# EAGLE schematic A500_GRAKA_26 (EAGLE 6.6.0)

## Sheet 1 of 2
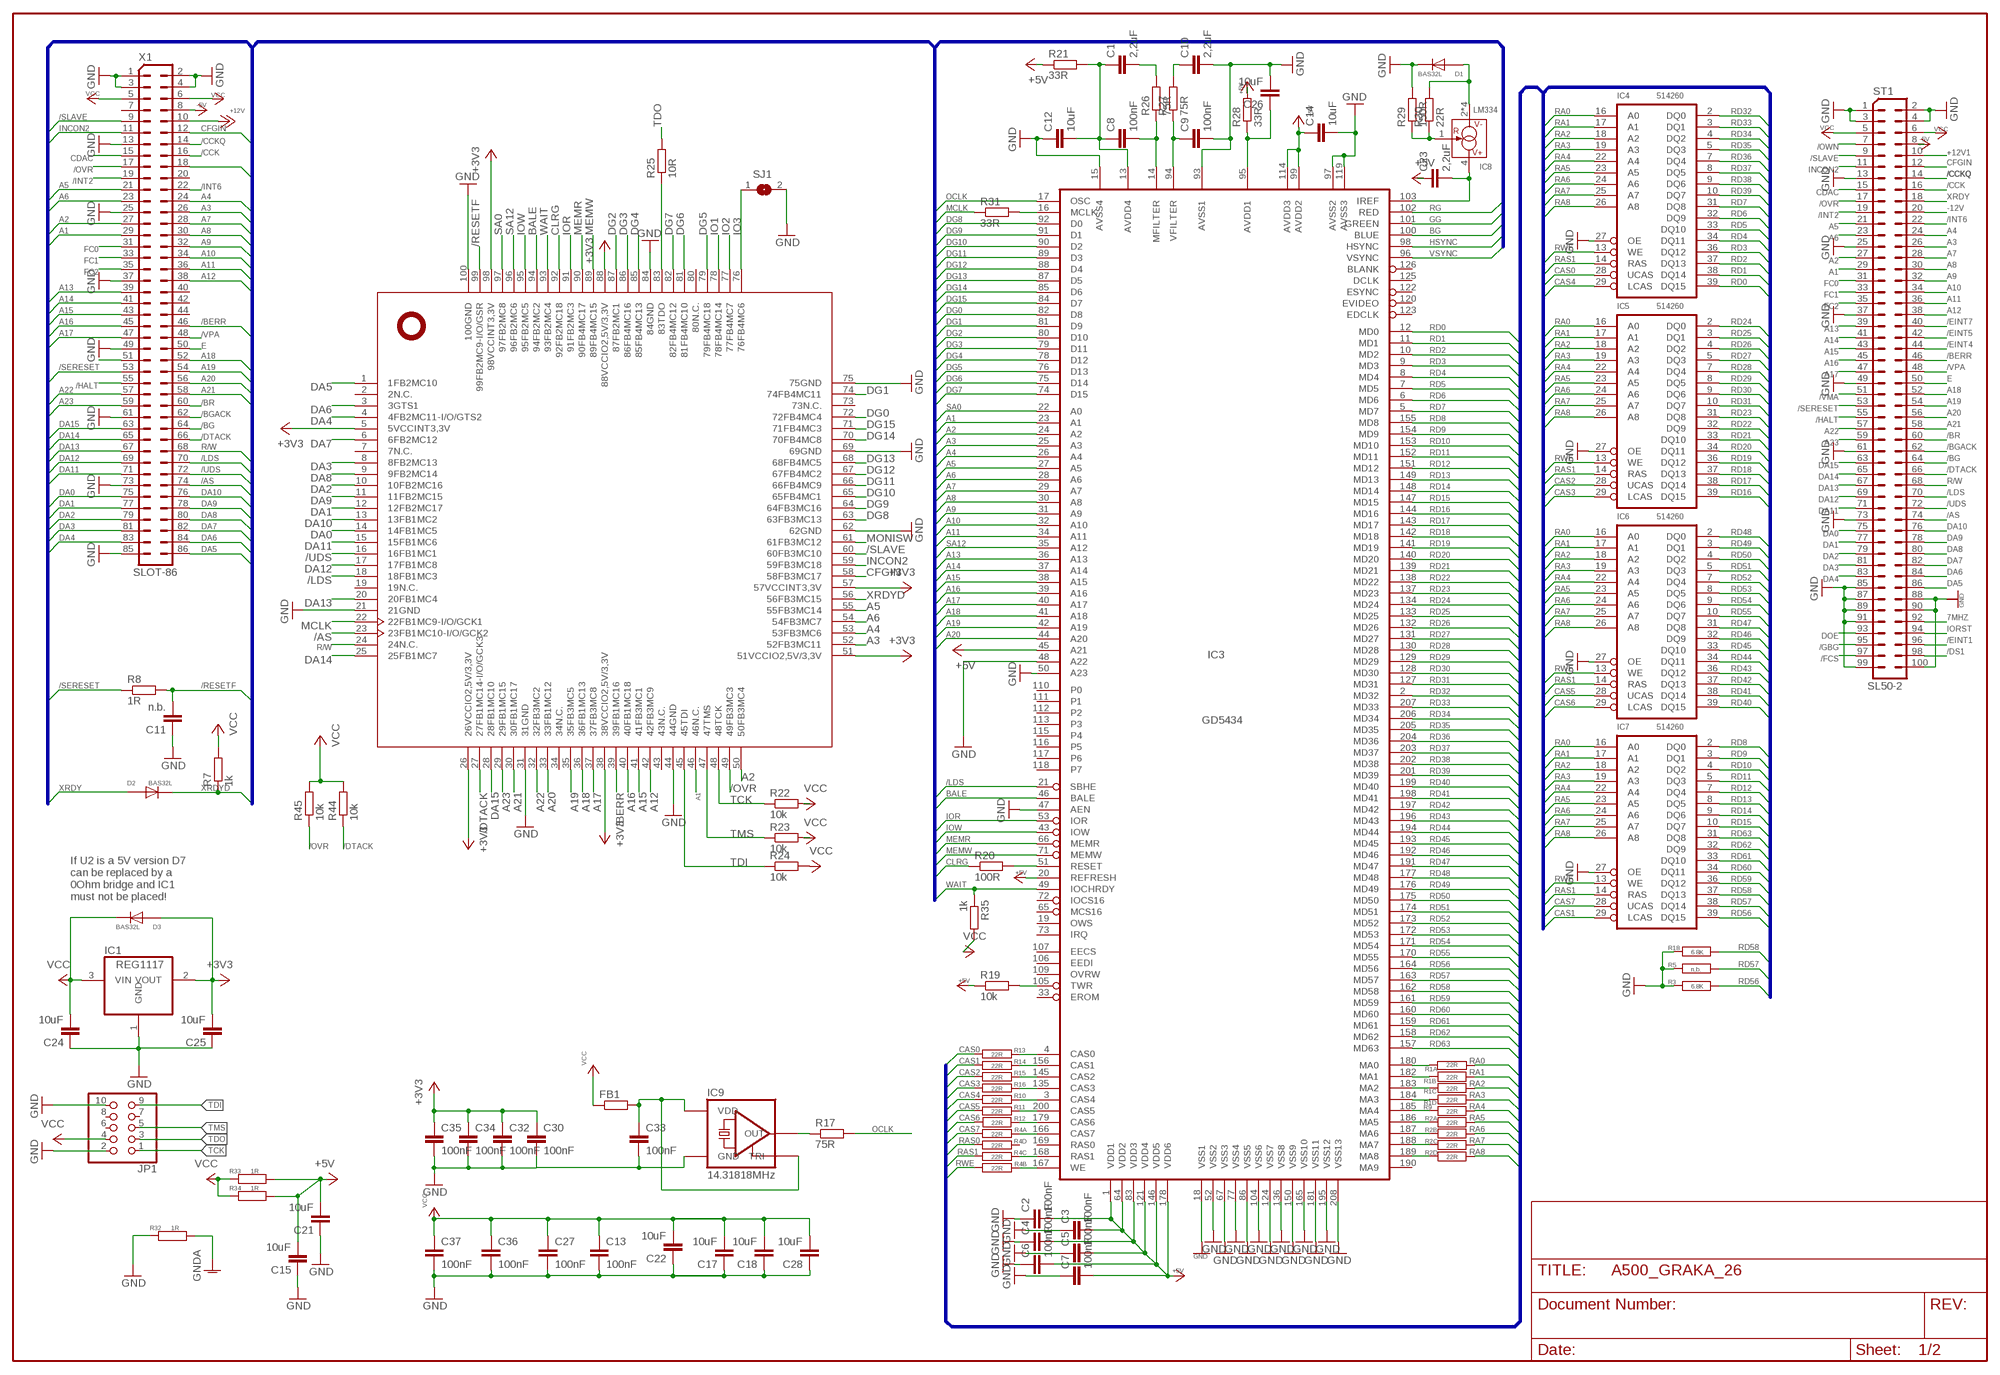
[diagram p0: schematic, sheet 1]

### Parts
C1  2,2uF  C-EUC0805K  [C0805K]
C2  100nF  C-EUC0805K  [C0805K]
C3  100nF  C-EUC0805K  [C0805K]
C4  100nF  C-EUC0805K  [C0805K]
C5  100nF  C-EUC0805K  [C0805K]
C6  100nF  C-EUC0805K  [C0805K]
C7  100nF  C-EUC0805K  [C0805K]
C8  100nF  C-EUC0805K  [C0805K]
C9  100nF  C-EUC0805K  [C0805K]
C10  2,2uF  C-EUC0805K  [C0805K]
C11  n.b.  C-EUC0805K  [C0805K]
C12  10uF  C-EUC0805K  [C0805K]
C13  100nF  C-EUC0805K  [C0805K]
C14  10uF  C-EUC0805K  [C0805K]
C15  10uF  C-EUC0805K  [C0805K]
C17  10uF  C-EUC0805K  [C0805K]
C18  10uF  C-EUC0805K  [C0805K]
C21  10uF  C-EUC0805K  [C0805K]
C22  10uF  C-EUC0805K  [C0805K]
C23  2,2uF  C-EUC0805K  [C0805K]
C24  10uF  C-EUC0805K  [C0805K]
C25  10uF  C-EUC0805K  [C0805K]
C26  10uF  C-EUC0805K  [C0805K]
C27  100nF  C-EUC0805K  [C0805K]
C28  10uF  C-EUC0805K  [C0805K]
C30  100nF  C-EUC0805K  [C0805K]
C32  100nF  C-EUC0805K  [C0805K]
C33  100nF  C-EUC0805K  [C0805K]
C34  100nF  C-EUC0805K  [C0805K]
C35  100nF  C-EUC0805K  [C0805K]
C36  100nF  C-EUC0805K  [C0805K]
C37  100nF  C-EUC0805K  [C0805K]
D1  BAS32L  D-BAS32L  [SOD-80]
D2  BAS32L  D-BAS32L  [SOD-80]
D3  BAS32L  D-BAS32L  [SOD-80]
FB1  R-EU_R0805  [R0805]
IC1  REG1117  [SOT223]
IC2  XC95144XLTQ100  XC9572XLTQ100  [TQ100]
IC3  GD5434  GD5434@3  [PQFP-208@3]
IC4  514260  [SOJ40/4]
IC5  514260  [SOJ40/4]
IC6  514260  [SOJ40/4]
IC7  514260  [SOJ40/4]
IC8  LM334  LM334M(TI)  [SO08]
IC9  14.31818MHz  CSX-750FCFC(5V)  [7X5]
JP1  PINHD-2X5_2.54-SMD  [2X05SMD]
R1  22R  R-NETZ  [R-NETZ]
R2  22R  R-NETZ  [R-NETZ]
R3  6.8K  R-MELF@4  [0805@2]
R4  22R  R-NETZ  [R-NETZ]
R5  n.b.  R-MELF@4  [0805@2]
R7  1k  R-EU_R0805  [R0805]
R8  1R  R-EU_R0805  [R0805]
R9  22R  R-MELF@4  [0805@2]
R10  22R  R-MELF@4  [0805@2]
R11  22R  R-MELF@4  [0805@2]
R12  22R  R-MELF@4  [0805@2]
R13  22R  R-MELF@4  [0805@2]
R14  22R  R-MELF@4  [0805@2]
R15  22R  R-MELF@4  [0805@2]
R16  22R  R-MELF@4  [0805@2]
R17  75R  R-EU_R0805  [R0805]
R18  6.8K  R-MELF@4  [0805@2]
R19  10k  R-EU_R0805  [R0805]
R20  100R  R-EU_R0805  [R0805]
R21  33R  R-EU_R0805  [R0805]
R22  10k  R-EU_R0805  [R0805]
R23  10k  R-EU_R0805  [R0805]
R24  10k  R-EU_R0805  [R0805]
R25  10R  R-EU_R0805  [R0805]
R26  75R  R-EU_R0805  [R0805]
R27  75R  R-EU_R0805  [R0805]
R28  33R  R-EU_R0805  [R0805]
R29  150R  R-EU_R0805  [R0805]
R30  22R  R-EU_R0805  [R0805]
R31  33R  R-EU_R0805  [R0805]
R32  1R  R-MELF@3  [0204]
R33  1R  R-MELF@3  [0204]
R34  1R  R-MELF@3  [0204]
R35  1k  R-EU_R0805  [R0805]
R44  10k  R-EU_R0805  [R0805]
R45  10k  R-EU_R0805  [R0805]
SJ1  SJ  [SJ]
ST1  SL50-2  SL50-2@3  [LKOT-501]
X1  SLOT-86  [SLOT-86]

### Nets
7MHZ: ST1.92
+3V3: C25.2 C30.1 C32.1 C34.1 C35.1 D3.1(A) IC1.2(VOUT) IC2.5(5VCCINT3,3V) IC2.26(26VCCIO2,5V/3,3V) IC2.38(38VCCIO2,5V/3,3V) IC2.51(51VCCIO2,5V/3,3V) IC2.57(57VCCINT3,3V) IC2.88(88VCCIO2,5V/3,3V) IC2.98(98VCCINT3,3V)
+5V: C2.2 C3.2 C4.2 C5.2 C6.2 C7.2 C14.1 C15.2 C21.2 C23.1 IC3.1(VDD1) IC3.20(REFRESH) IC3.45(A21) IC3.64(VDD2) IC3.83(VDD3) IC3.99(AVDD2) IC3.114(AVDD3) IC3.121(VDD4) IC3.146(VDD5) IC3.178(VDD6) R19.1 R21.1 R28.2 R33.1 R34.1
+12V: X1.10
+12V1: ST1.10
-5V: ST1.8 X1.8
-12V: ST1.20
/AS: IC2.23(23FB1MC10-I/O/GCK2) ST1.74 X1.74
/BERR: IC2.39(39FB1MC16) ST1.46 X1.46
/BG: ST1.64 X1.64
/BGACK: ST1.62 X1.62
/BR: ST1.60 X1.60
/CCK: ST1.16 X1.16
/CCKQ: ST1.14 X1.14
/DS1: ST1.98
/DTACK: IC2.27(27FB1MC14-I/O/GCK3) R44.1 ST1.66 X1.66
/EINT1: ST1.96
/EINT4: ST1.44
/EINT5: ST1.42
/EINT7: ST1.40
/FCS: ST1.97
/GBG: ST1.95
/HALT: ST1.55 X1.55
/INT2: ST1.19 X1.19
/INT6: ST1.22 X1.22
/LDS: IC2.18(18FB1MC3) IC3.21(SBHE) ST1.70 X1.70
/OVR: IC2.49(49FB3MC3) R45.1 ST1.17 X1.17
/OWN: ST1.7
/RESETF: C11.2 IC2.99(99FB2MC9-I/O/GSR) R8.2
/SERESET: R8.1 ST1.53 X1.53
/SLAVE: IC2.60(60FB3MC10) ST1.9 X1.9
/UDS: IC2.16(16FB1MC1) ST1.72 X1.72
/VMA: ST1.51 X1.51
/VPA: ST1.48 X1.48
A1: IC2.46(46N.C.) IC3.23(A1) ST1.29 X1.29
A2: IC2.50(50FB3MC4) IC3.24(A2) ST1.27 X1.27
A3: IC2.52(52FB3MC11) IC3.25(A3) ST1.26 X1.26
A4: IC2.53(53FB3MC6) IC3.26(A4) ST1.24 X1.24
A5: IC2.55(55FB3MC14) IC3.27(A5) ST1.21 X1.21
A6: IC2.54(54FB3MC7) IC3.28(A6) ST1.23 X1.23
A7: IC3.29(A7) ST1.28 X1.28
A8: IC3.30(A8) ST1.30 X1.30
A9: IC3.31(A9) ST1.32 X1.32
A10: IC3.32(A10) ST1.34 X1.34
A11: IC3.34(A11) ST1.36 X1.36
A12: IC2.42(42FB3MC9) ST1.38 X1.38
A13: IC3.36(A13) ST1.39 X1.39
A14: IC3.37(A14) ST1.41 X1.41
A15: IC2.41(41FB3MC1) IC3.38(A15) ST1.43 X1.43
A16: IC2.40(40FB1MC18) IC3.39(A16) ST1.45 X1.45
A17: IC2.37(37FB3MC8) IC3.40(A17) ST1.47 X1.47
A18: IC2.36(36FB1MC13) IC3.41(A18) ST1.52 X1.52
A19: IC2.35(35FB3MC5) IC3.42(A19) ST1.54 X1.54
A20: IC2.33(33FB1MC12) IC3.44(A20) ST1.56 X1.56
A21: IC2.30(30FB1MC17) ST1.58 X1.58
A22: IC2.32(32FB3MC2) ST1.57 X1.57
A23: IC2.29(29FB1MC15) ST1.59 X1.59
AVDD1: C26.1 IC3.95(AVDD1) R28.1
AVDD4: C1.1 C8.1 C12.2 IC3.13(AVDD4) R21.2
BALE: IC2.94(94FB2MC2) IC3.46(BALE)
BG: IC3.100(BLUE) ; also sheet 2
CAS0: IC4.28(UCAS) R13.1
CAS1: IC7.29(LCAS) R14.1
CAS2: IC5.28(UCAS) R15.1
CAS3: IC5.29(LCAS) R16.1
CAS4: IC4.29(LCAS) R10.1
CAS5: IC6.28(UCAS) R11.1
CAS6: IC6.29(LCAS) R12.2
CAS7: IC7.28(UCAS) R4.P$1
CDAC: ST1.15 X1.15
CFGIN: IC2.58(58FB3MC17) ST1.12 X1.12
CLRG: IC2.92(92FB2MC18) R20.1
DA0: IC2.14(14FB1MC5) ST1.75 X1.75
DA1: IC2.12(12FB2MC17) ST1.77 X1.77
DA2: IC2.10(10FB2MC16) ST1.79 X1.79
DA3: IC2.8(8FB2MC13) ST1.81 X1.81
DA4: IC2.4(4FB2MC11-I/O/GTS2) ST1.83 X1.83
DA5: IC2.1(1FB2MC10) ST1.86 X1.86
DA6: IC2.3(3GTS1) ST1.84 X1.84
DA7: IC2.6(6FB2MC12) ST1.82 X1.82
DA8: IC2.9(9FB2MC14) ST1.80 X1.80
DA9: IC2.11(11FB2MC15) ST1.78 X1.78
DA10: IC2.13(13FB1MC2) ST1.76 X1.76
DA11: IC2.15(15FB1MC6) ST1.71 X1.71
DA12: IC2.17(17FB1MC8) ST1.69 X1.69
DA13: IC2.20(20FB1MC4) ST1.67 X1.67
DA14: IC2.25(25FB1MC7) ST1.65 X1.65
DA15: IC2.28(28FB1MC10) ST1.63 X1.63
DG0: IC2.72(72FB4MC4) IC3.82(D8)
DG1: IC2.74(74FB4MC11) IC3.81(D9)
DG2: IC2.87(87FB2MC1) IC3.80(D10)
DG3: IC2.86(86FB4MC16) IC3.79(D11)
DG4: IC2.85(85FB4MC13) IC3.78(D12)
DG5: IC2.79(79FB4MC18) IC3.76(D13)
DG6: IC2.81(81FB4MC10) IC3.75(D14)
DG7: IC2.82(82FB4MC12) IC3.74(D15)
DG8: IC2.63(63FB3MC13) IC3.92(D0)
DG9: IC2.64(64FB3MC16) IC3.91(D1)
DG10: IC2.65(65FB4MC1) IC3.90(D2)
DG11: IC2.66(66FB4MC9) IC3.89(D3)
DG12: IC2.67(67FB4MC2) IC3.88(D4)
DG13: IC2.68(68FB4MC5) IC3.87(D5)
DG14: IC2.70(70FB4MC8) IC3.85(D6)
DG15: IC2.71(71FB4MC3) IC3.84(D7)
DOE: ST1.93
E: ST1.50 X1.50
FC0: ST1.31 X1.31
FC1: ST1.33 X1.33
FC2: ST1.35 X1.35
GG: IC3.101(GREEN) ; also sheet 2
GND: C2.1 C3.1 C4.1 C5.1 C6.1 C7.1 C9.2 C10.2 C11.1 C12.1 C13.2 C14.2 C15.1 C17.1 C18.1 C21.1 C22.1 C24.1 C25.1 C26.2 C27.2 C28.1 C30.2 C32.2 C33.2 C34.2 C35.2 C36.2 C37.2 D1.2(K) IC1.1(GND) IC2.21(21GND) IC2.31(31GND) IC2.44(44GND) IC2.62(62GND) IC2.69(69GND) IC2.75(75GND) IC2.84(84GND) IC2.100(100GND) IC3.15(AVSS4) IC3.18(VSS1) IC3.47(AEN) IC3.48(A22) IC3.50(A23) IC3.52(VSS2) IC3.67(VSS3) IC3.77(VSS4) IC3.86(VSS5) IC3.93(AVSS1) IC3.97(AVSS2) IC3.104(VSS6) IC3.119(AVSS3) IC3.124(VSS7) IC3.136(VSS8) IC3.150(VSS9) IC3.165(VSS10) IC3.181(VSS11) IC3.195(VSS12) IC3.208(VSS13) IC4.27(OE) IC5.27(OE) IC6.27(OE) IC7.27(OE) IC9.P$2(GND) JP1.2 JP1.10 R3.2 R5.2 R18.2 R29.2 R32.2 SJ1.2 ST1.1 ST1.2 ST1.3 ST1.4 ST1.13 ST1.25 ST1.37 ST1.49 ST1.61 ST1.73 ST1.85 ST1.87 ST1.88 ST1.89 ST1.90 ST1.91 ST1.99 ST1.100 X1.1 X1.2 X1.3 X1.4 X1.13 X1.25 X1.37 X1.49 X1.61 X1.73 X1.85 ; also sheet 2
GNDA: R32.1 ; also sheet 2
HSYNC: IC3.98(HSYNC) ; also sheet 2
INCON2: IC2.59(59FB3MC18) ST1.11 X1.11
IO1: IC2.78(78FB4MC14)
IO2: IC2.77(77FB4MC7)
IO3: IC2.76(76FB4MC6) SJ1.1
IOR: IC2.91(91FB2MC3) IC3.53(IOR)
IORST: ST1.94
IOW: IC2.95(95FB2MC5) IC3.43(IOW)
MCLK: IC2.22(22FB1MC9-I/O/GCK1) R31.1
MEMR: IC2.90(90FB4MC17) IC3.66(MEMR)
MEMW: IC2.89(89FB4MC15) IC3.71(MEMW)
MONISW: IC2.61(61FB3MC12) ; also sheet 2
N$1: IC3.185(MA4) R9.2
N$2: IC3.180(MA0) R1.P$8
N$3: IC3.182(MA1) R1.P$7
N$4: IC3.186(MA5) R2.P$8
N$5: IC3.187(MA6) R2.P$7
N$6: IC3.188(MA7) R2.P$6
N$7: IC3.189(MA8) R2.P$5
N$8: IC3.183(MA2) R1.P$6
N$9: C33.1 FB1.2 IC9.P$1(TRI) IC9.P$4(VDD)
N$11: IC3.184(MA3) R1.P$5
N$12: IC3.3(CAS4) R10.2
N$13: IC3.200(CAS5) R11.2
N$14: IC3.179(CAS6) R12.1
N$16: IC3.4(CAS0) R13.2
N$17: IC3.156(CAS1) R14.2
N$18: IC3.145(CAS2) R15.2
N$19: IC3.135(CAS3) R16.2
N$20: IC3.16(MCLK) R31.2
N$21: IC9.P$3(OUT) R17.1
N$23: C1.2 R26.2
N$24: C8.2 IC3.14(MFILTER) R26.1
N$26: C9.1 IC3.94(VFILTER) R27.1
N$28: IC3.51(RESET) R20.2
N$29: C10.1 R27.2
N$30: C23.2 IC3.103(IREF) IC8.4(V+)
N$31: IC8.1(R) R29.1 R30.1
N$32: D1.1(A) IC8.2(V-) IC8.3(V-) IC8.6(V-) IC8.7(V-) R30.2
N$46: IC3.105(TWR) R19.2
N$51: IC3.166(CAS7) R4.P$8
N$53: IC3.168(RAS1) R4.P$6
N$54: IC3.167(WE) R4.P$7
OCLK: IC3.17(OSC) R17.2
R/W: IC2.24(24N.C.) ST1.68 X1.68
RA0: IC4.16(A0) IC5.16(A0) IC6.16(A0) IC7.16(A0) R1.P$1
RA1: IC4.17(A1) IC5.17(A1) IC6.17(A1) IC7.17(A1) R1.P$2
RA2: IC4.18(A2) IC5.18(A2) IC6.18(A2) IC7.18(A2) R1.P$3
RA3: IC4.19(A3) IC5.19(A3) IC6.19(A3) IC7.19(A3) R1.P$4
RA4: IC4.22(A4) IC5.22(A4) IC6.22(A4) IC7.22(A4) R9.1
RA5: IC4.23(A5) IC5.23(A5) IC6.23(A5) IC7.23(A5) R2.P$1
RA6: IC4.24(A6) IC5.24(A6) IC6.24(A6) IC7.24(A6) R2.P$2
RA7: IC4.25(A7) IC5.25(A7) IC6.25(A7) IC7.25(A7) R2.P$3
RA8: IC4.26(A8) IC5.26(A8) IC6.26(A8) IC7.26(A8) R2.P$4
RAS0: R4.P$4
RAS1: IC4.14(RAS) IC5.14(RAS) IC6.14(RAS) IC7.14(RAS) R4.P$3
RD0: IC3.12(MD0) IC4.39(DQ15)
RD1: IC3.11(MD1) IC4.38(DQ14)
RD2: IC3.10(MD2) IC4.37(DQ13)
RD3: IC3.9(MD3) IC4.36(DQ12)
RD4: IC3.8(MD4) IC4.34(DQ11)
RD5: IC3.7(MD5) IC4.33(DQ10)
RD6: IC3.6(MD6) IC4.32(DQ9)
RD7: IC3.5(MD7) IC4.31(DQ8)
RD8: IC3.155(MD8) IC7.2(DQ0)
RD9: IC3.154(MD9) IC7.3(DQ1)
RD10: IC3.153(MD10) IC7.4(DQ2)
RD11: IC3.152(MD11) IC7.5(DQ3)
RD12: IC3.151(MD12) IC7.7(DQ4)
RD13: IC3.149(MD13) IC7.8(DQ5)
RD14: IC3.148(MD14) IC7.9(DQ6)
RD15: IC3.147(MD15) IC7.10(DQ7)
RD16: IC3.144(MD16) IC5.39(DQ15)
RD17: IC3.143(MD17) IC5.38(DQ14)
RD18: IC3.142(MD18) IC5.37(DQ13)
RD19: IC3.141(MD19) IC5.36(DQ12)
RD20: IC3.140(MD20) IC5.34(DQ11)
RD21: IC3.139(MD21) IC5.33(DQ10)
RD22: IC3.138(MD22) IC5.32(DQ9)
RD23: IC3.137(MD23) IC5.31(DQ8)
RD24: IC3.134(MD24) IC5.2(DQ0)
RD25: IC3.133(MD25) IC5.3(DQ1)
RD26: IC3.132(MD26) IC5.4(DQ2)
RD27: IC3.131(MD27) IC5.5(DQ3)
RD28: IC3.130(MD28) IC5.7(DQ4)
RD29: IC3.129(MD29) IC5.8(DQ5)
RD30: IC3.128(MD30) IC5.9(DQ6)
RD31: IC3.127(MD31) IC5.10(DQ7)
RD32: IC3.2(MD32) IC4.2(DQ0)
RD33: IC3.207(MD33) IC4.3(DQ1)
RD34: IC3.206(MD34) IC4.4(DQ2)
RD35: IC3.205(MD35) IC4.5(DQ3)
RD36: IC3.204(MD36) IC4.7(DQ4)
RD37: IC3.203(MD37) IC4.8(DQ5)
RD38: IC3.202(MD38) IC4.9(DQ6)
RD39: IC3.201(MD39) IC4.10(DQ7)
RD40: IC3.199(MD40) IC6.39(DQ15)
RD41: IC3.198(MD41) IC6.38(DQ14)
RD42: IC3.197(MD42) IC6.37(DQ13)
RD43: IC3.196(MD43) IC6.36(DQ12)
RD44: IC3.194(MD44) IC6.34(DQ11)
RD45: IC3.193(MD45) IC6.33(DQ10)
RD46: IC3.192(MD46) IC6.32(DQ9)
RD47: IC3.191(MD47) IC6.31(DQ8)
RD48: IC3.177(MD48) IC6.2(DQ0)
RD49: IC3.176(MD49) IC6.3(DQ1)
RD50: IC3.175(MD50) IC6.4(DQ2)
RD51: IC3.174(MD51) IC6.5(DQ3)
RD52: IC3.173(MD52) IC6.7(DQ4)
RD53: IC3.172(MD53) IC6.8(DQ5)
RD54: IC3.171(MD54) IC6.9(DQ6)
RD55: IC3.170(MD55) IC6.10(DQ7)
RD56: IC3.164(MD56) IC7.39(DQ15) R3.1
RD57: IC3.163(MD57) IC7.38(DQ14) R5.1
RD58: IC3.162(MD58) IC7.37(DQ13) R18.1
RD59: IC3.161(MD59) IC7.36(DQ12)
RD60: IC3.160(MD60) IC7.34(DQ11)
RD61: IC3.159(MD61) IC7.33(DQ10)
RD62: IC3.158(MD62) IC7.32(DQ9)
RD63: IC3.157(MD63) IC7.31(DQ8)
RG: IC3.102(RED) ; also sheet 2
RWE: IC4.13(WE) IC5.13(WE) IC6.13(WE) IC7.13(WE) R4.P$2
SA0: IC2.97(97FB2MC8) IC3.22(A0)
SA12: IC2.96(96FB2MC6) IC3.35(A12)
TCK: IC2.48(48TCK) JP1.1 R22.1
TDI: IC2.45(45TDI) JP1.9 R24.1
TDO: JP1.3 R25.2
TDO1: IC2.83(83TDO) R25.1
TMS: IC2.47(47TMS) JP1.5 R23.1
VCC: C13.1 C17.2 C18.2 C22.2 C24.2 C27.1 C28.2 C36.1 C37.1 D3.2(K) FB1.1 IC1.3(VIN) JP1.4 R7.2 R22.2 R23.2 R24.2 R33.2 R34.2 R35.2 R44.2 R45.2 ST1.5 ST1.6 X1.5 X1.6 ; also sheet 2
VSYNC: IC3.96(VSYNC) ; also sheet 2
WAIT: IC2.93(93FB2MC4) IC3.49(IOCHRDY) R35.1
XRDY: D2.1(A) ST1.18 X1.18
XRDYD: D2.2(K) IC2.56(56FB3MC15) R7.1
Unconnected: IC2.2(2N.C.) IC2.7(7N.C.) IC2.19(19N.C.) IC2.34(34N.C.) IC2.43(43N.C.) IC2.73(73N.C.) IC2.80(80N.C.) IC3.19(OWS) IC3.33(EROM) IC3.65(MCS16) IC3.72(IOCS16) IC3.73(IRQ) IC3.106(EEDI) IC3.107(EECS) IC3.109(OVRW) IC3.110(P0) IC3.111(P1) IC3.112(P2) IC3.113(P3) IC3.115(P4) IC3.116(P5) IC3.117(P6) IC3.118(P7) IC3.120(EVIDEO) IC3.122(ESYNC) IC3.123(EDCLK) IC3.125(DCLK) IC3.126(BLANK) IC3.169(RAS0) IC3.190(MA9) JP1.6 JP1.7 JP1.8 R4.P$5 X1.7 X1.20 X1.40 X1.42 X1.44

### Buses
A[1..23],DA[0..15],DG[0..15],SA0,SA12,IOW,IOR,MEMW,MEMR,WAIT,SBHE,BALE,MCLK,IRQ,CAP[16..23],OEAG,OEGA,LEGA,/AS,/BERR
RD[0..63],RA[0..8],RAS[0..1],LCAS[0..1],UCAS[0..1]

### Notes on the sheet
- /CCKQ | /CCKQ
- /CCK
- -12V
- /INT6
- /EINT7
- /EINT5
- /EINT4
- /VPA
- E
- /BR
- /BGACK
- /BG
- /DTACK
- If U2 is a 5V version D7 
  can be replaced by a 
  0Ohm bridge and IC1 
  must not be placed!

## Sheet 2 of 2
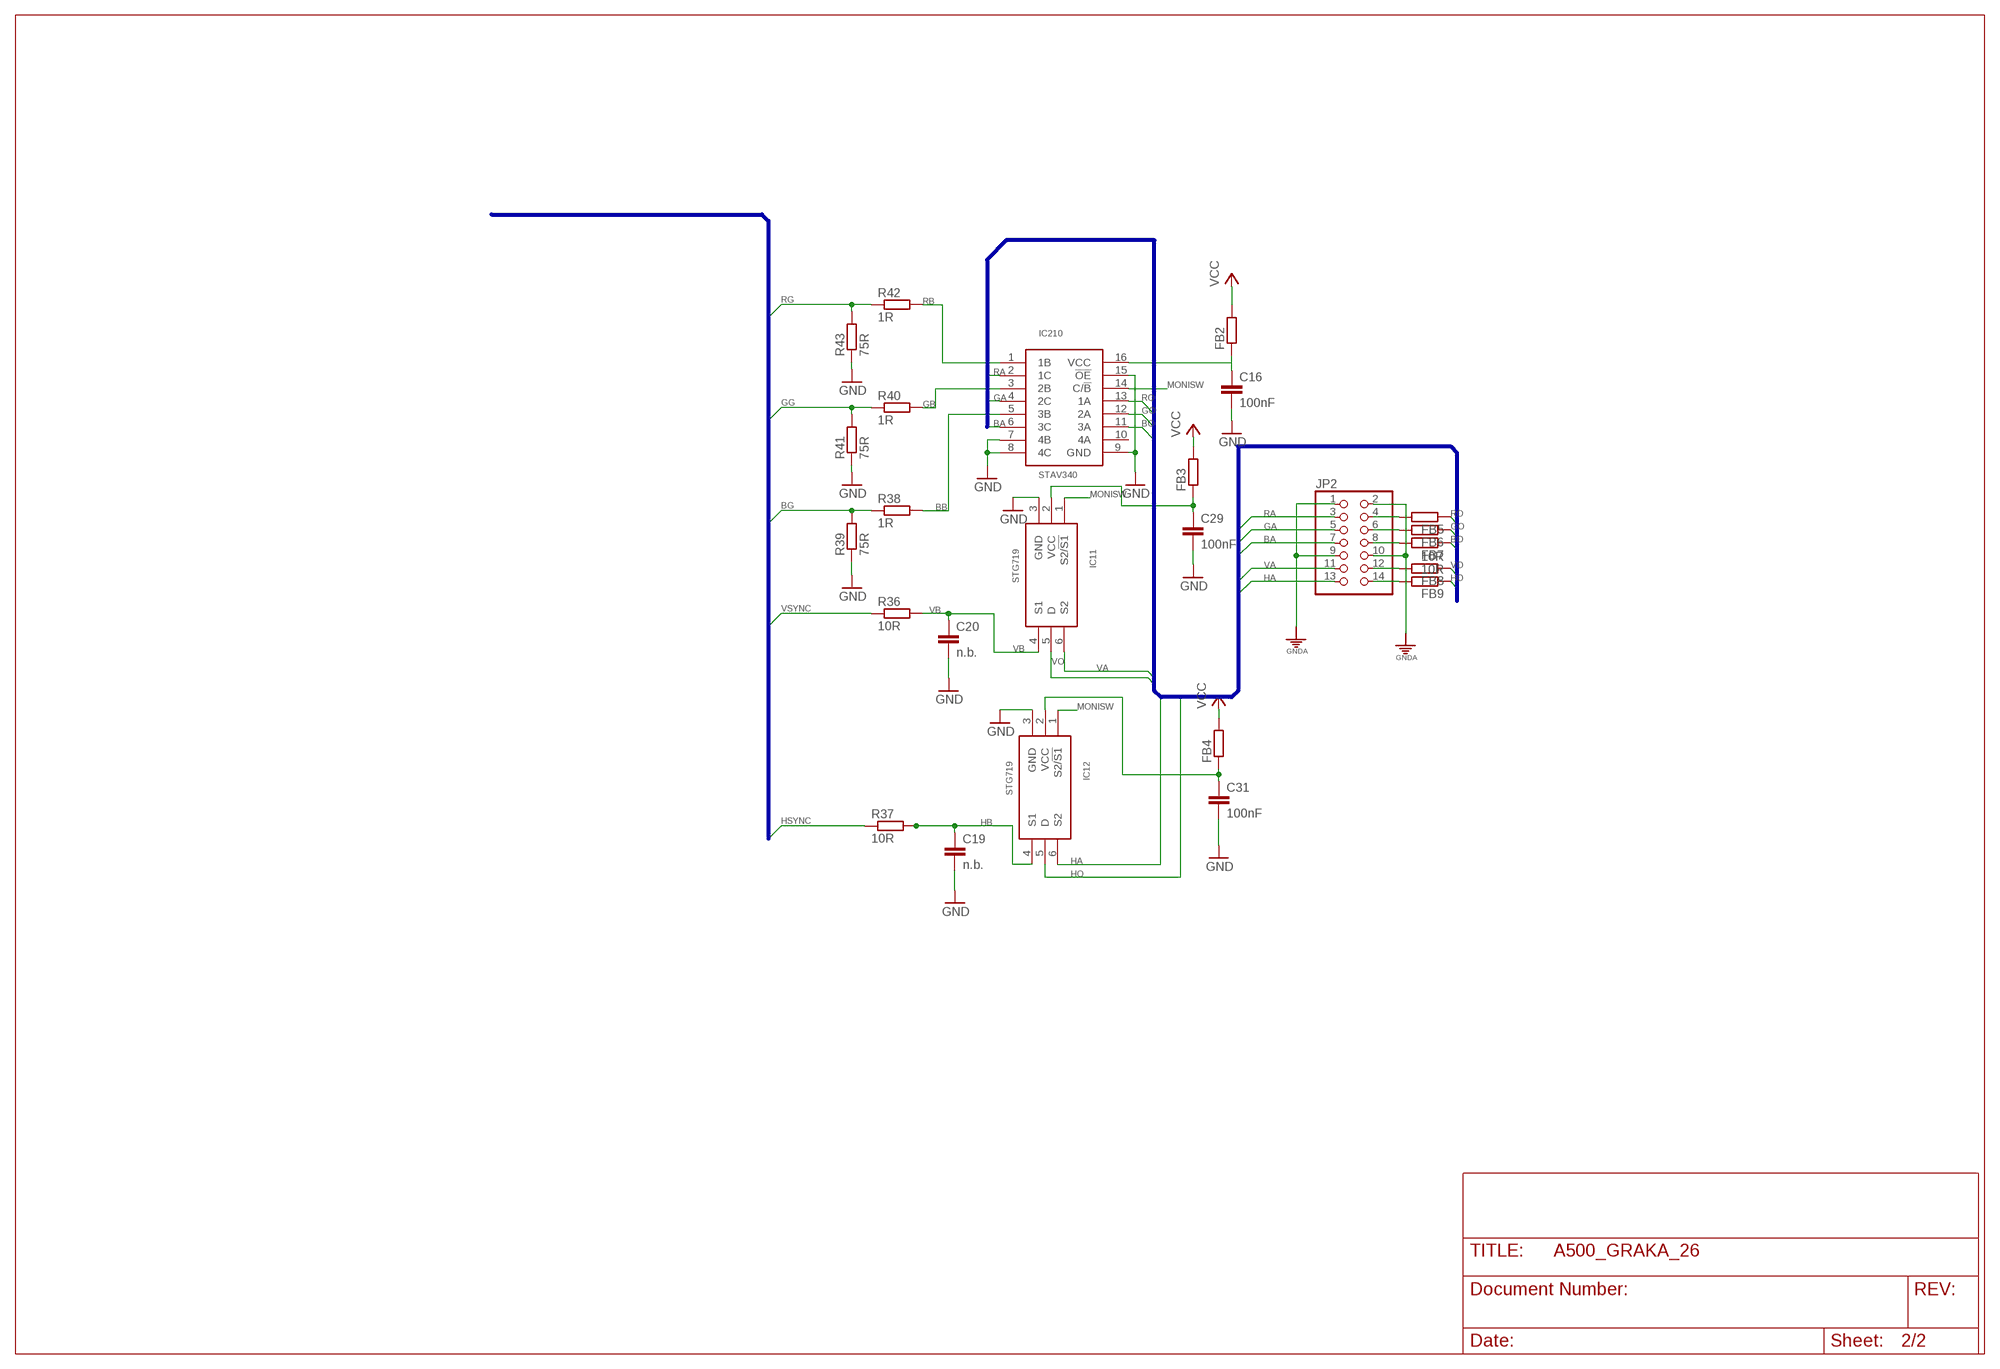
[diagram p1: schematic, sheet 2]

### Parts
C16  100nF  C-EUC0805K  [C0805K]
C19  n.b.  C-EUC0805K  [C0805K]
C20  n.b.  C-EUC0805K  [C0805K]
C29  100nF  C-EUC0805K  [C0805K]
C31  100nF  C-EUC0805K  [C0805K]
FB2  R-EU_R0805  [R0805]
FB3  R-EU_R0805  [R0805]
FB4  R-EU_R0805  [R0805]
FB5  R-EU_R0805  [R0805]
FB6  R-EU_R0805  [R0805]
FB7  R-EU_R0805  [R0805]
FB8  10R  R-EU_R0805  [R0805]
FB9  10R  R-EU_R0805  [R0805]
IC11  STG719  [SOT23-6L]
IC12  STG719  [SOT23-6L]
IC210  STAV340  [TSSOP16]
JP2  PINHD-2X7_2.54-SMD  [2X07SMD]
R36  10R  R-EU_R0805  [R0805]
R37  10R  R-EU_R0805  [R0805]
R38  1R  R-EU_R0805  [R0805]
R39  75R  R-EU_R0805  [R0805]
R40  1R  R-EU_R0805  [R0805]
R41  75R  R-EU_R0805  [R0805]
R42  1R  R-EU_R0805  [R0805]
R43  75R  R-EU_R0805  [R0805]

### Nets
BA: IC210.6(3C) JP2.7
BB: IC210.5(3B) R38.2
BG: R38.1 R39.2 ; also sheet 1
BO: FB7.1 IC210.11(3A)
GA: IC210.4(2C) JP2.5
GB: IC210.3(2B) R40.2
GG: R40.1 R41.2 ; also sheet 1
GND: C16.2 C19.2 C20.2 C29.2 C31.2 IC11.3(GND) IC12.3(GND) IC210.7(4B) IC210.8(4C) IC210.9(GND) IC210.15(!OE) R39.1 R41.1 R43.1 ; also sheet 1
GNDA: JP2.1 JP2.2 JP2.9 JP2.10 ; also sheet 1
GO: FB6.1 IC210.12(2A)
HA: IC12.6(S2) JP2.13
HB: C19.1 IC12.4(S1) R37.2
HO: FB9.1 IC12.5(D)
HSYNC: R37.1 ; also sheet 1
MONISW: IC11.1(S2/!S1) IC12.1(S2/!S1) IC210.14(C/!B) ; also sheet 1
N$22: C16.1 FB2.1 IC210.16(VCC)
N$25: FB7.2 JP2.8
N$27: C29.1 FB3.1 IC11.2(VCC)
N$33: C31.1 FB4.1 IC12.2(VCC)
N$34: FB6.2 JP2.6
N$35: FB5.2 JP2.4
N$36: FB8.2 JP2.12
N$37: FB9.2 JP2.14
RA: IC210.2(1C) JP2.3
RB: IC210.1(1B) R42.2
RG: R42.1 R43.2 ; also sheet 1
RO: FB5.1 IC210.13(1A)
VA: IC11.6(S2) JP2.11
VB: C20.1 IC11.4(S1) R36.2
VCC: FB2.2 FB3.2 FB4.2 ; also sheet 1
VO: FB8.1 IC11.5(D)
VSYNC: R36.1 ; also sheet 1
Unconnected: IC210.10(4A)

### Buses
RA,GA,BA,VA,HA,RO,GO,BO,VO,HO
A[1..23],DA[0..15],DG[0..15],SA0,SA12,IOW,IOR,MEMW,MEMR,WAIT,SBHE,BALE,MCLK,IRQ,CAP[16..23],OEAG,OEGA,LEGA,/AS,/BERR

## Power pins joined to a net without a drawn wire
GND: IC4.21(GND) IC4.35(GND) IC4.40(GND) IC5.21(GND) IC5.35(GND) IC5.40(GND) IC6.21(GND) IC6.35(GND) IC6.40(GND) IC7.21(GND) IC7.35(GND) IC7.40(GND)
VCC: IC4.1(VCC) IC4.6(VCC) IC4.20(VCC) IC5.1(VCC) IC5.6(VCC) IC5.20(VCC) IC6.1(VCC) IC6.6(VCC) IC6.20(VCC) IC7.1(VCC) IC7.6(VCC) IC7.20(VCC)

## Library data of the parts
C1-C37 = rcl:C-EU: CAPACITOR, European symbol
D1-D3 = SMD:D-BAS32L
FB1-FB9 R7 R8 R17 R19-R31 R35-R45 = rcl:R-EU_: RESISTOR, European symbol
IC1 = burr-brown:REG1117: 800mA and 1A Low Dropout (LDO) Positive Regulator 1.8V, 2.5V, 2.85V, 3.3V, 5V, and Adj; MPN: REG1117; OC_FARNELL: 1097566; OC_NEWARK: 14P6981
IC2 = xilinx_xc9572xl-tq100:XC9572XLTQ100
IC3 = SMD-IC:GD5434@3
IC4-IC7 = SMD-IC:514260
IC8 = linear:LM*34: 3-Terminal Adjustable Current Sources Source: www.national.com/pf/LM/LM334.html | LM134.pdf
IC9 = SMD-Crystal:CSX-750FC: CITIZEN Crystal Clock Oscilator from http://cfm.citizen.co.jp/english/product/pdf/CSX-750F.pdf
IC11 IC12 = ST_Switch:STG719
IC210 = ST_Switch:STAV340
JP1 = pinhead:PINHD-2X5: PIN HEADER
JP2 = pinhead:PINHD-2X7: PIN HEADER
R1 R2 R4 = SMD:R-NETZ
R3 R5 R9-R16 R18 = SMD:R-MELF@4
R32-R34 = SMD:R-MELF@3
SJ1 = jumper:SJ: SMD solder JUMPER
ST1 = Stecker:SL50-2@3
X1 = Stecker:SLOT-86